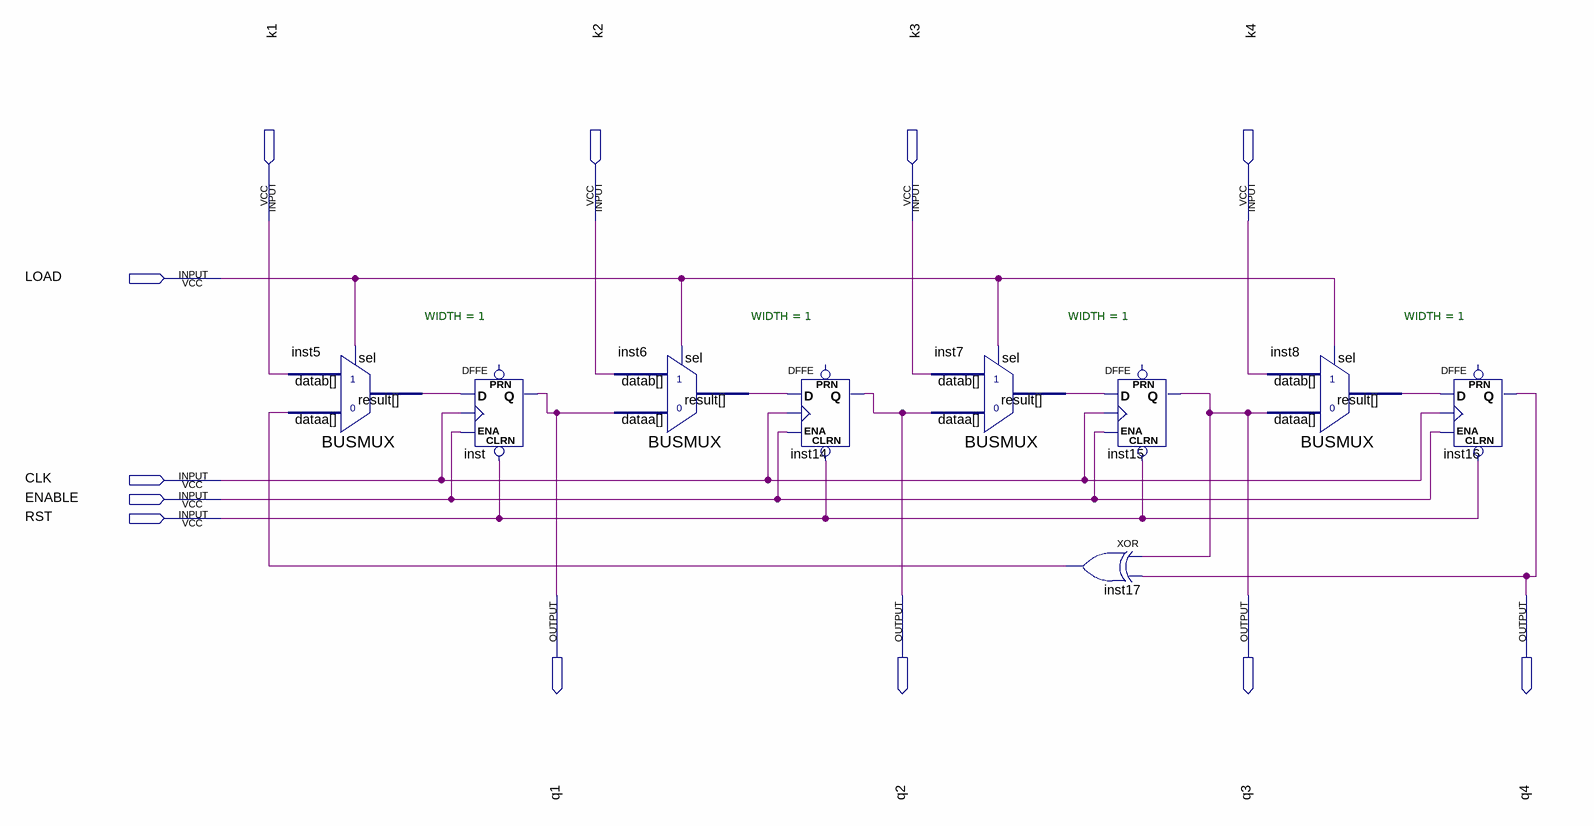
[diagram p0: schematic sheet]
// Quartus schematic LFSR.bdf as structural Verilog: 9 symbols, 12 pins
module LFSR (
  input  k1,
  input  k2,
  input  k3,
  input  k4,
  input  LOAD,
  input  CLK,
  input  ENABLE,
  input  RST,
  output q1,
  output q2,
  output q3,
  output q4
);

  wire inst5_result, inst6_result, inst7_result, inst8_result, inst17_out;

  BUSMUX #(.WIDTH(1)) inst5 (.datab(k1), .sel(LOAD), .dataa(inst17_out), .result(inst5_result));
  DFFE inst (.CLRN(RST), .D(inst5_result), .CLK(CLK), .ENA(ENABLE), .Q(q1));  // open: PRN
  BUSMUX #(.WIDTH(1)) inst6 (.datab(k2), .sel(LOAD), .dataa(q1), .result(inst6_result));
  DFFE inst14 (.CLRN(RST), .D(inst6_result), .CLK(CLK), .ENA(ENABLE), .Q(q2));  // open: PRN
  BUSMUX #(.WIDTH(1)) inst7 (.datab(k3), .sel(LOAD), .dataa(q2), .result(inst7_result));
  xor inst17 (inst17_out, q3, q4);
  DFFE inst15 (.CLRN(RST), .D(inst7_result), .CLK(CLK), .ENA(ENABLE), .Q(q3));  // open: PRN
  BUSMUX #(.WIDTH(1)) inst8 (.datab(k4), .sel(LOAD), .dataa(q3), .result(inst8_result));
  DFFE inst16 (.CLRN(RST), .D(inst8_result), .CLK(CLK), .ENA(ENABLE), .Q(q4));  // open: PRN
endmodule
